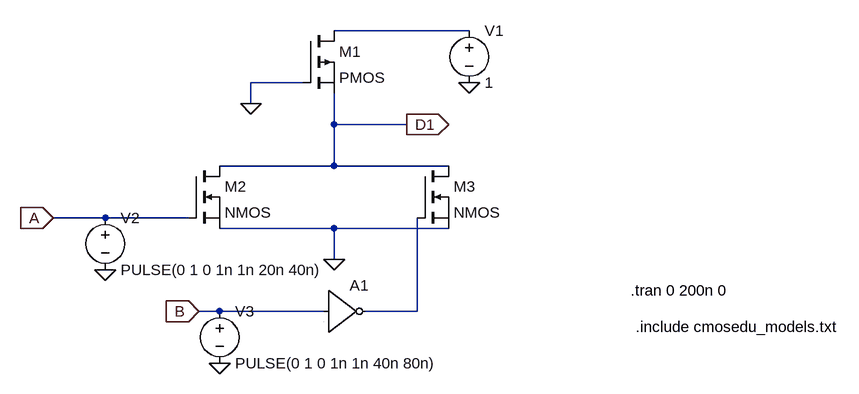
[diagram p0: schematic EXP 8 - D1.asc]
EXP 8 - D1.asc, the LTspice schematic file:
Version 4
SHEET 1 1156 680
WIRE 560 -64 352 -64
WIRE 304 16 224 16
WIRE 224 48 224 16
WIRE 352 80 352 32
WIRE 464 80 352 80
WIRE 352 144 352 80
WIRE 352 144 176 144
WIRE 528 144 352 144
WIRE 0 224 -80 224
WIRE 128 224 0 224
WIRE 352 240 176 240
WIRE 528 240 352 240
WIRE 352 288 352 240
WIRE 176 368 144 368
WIRE 336 368 176 368
WIRE 480 368 480 224
WIRE 480 368 400 368
FLAG 352 288 0
FLAG 0 304 0
FLAG 176 448 0
FLAG 560 16 0
FLAG -80 224 A
IOPIN -80 224 In
FLAG 144 368 B
IOPIN 144 368 In
FLAG 224 48 0
FLAG 464 80 D1
IOPIN 464 80 Out
SYMBOL pmos 304 -64 R0
SYMATTR InstName M1
SYMBOL nmos 128 144 R0
SYMATTR InstName M2
SYMBOL nmos 480 144 R0
SYMATTR InstName M3
SYMBOL voltage 560 -80 R0
WINDOW 123 0 0 Left 0
WINDOW 39 0 0 Left 0
SYMATTR InstName V1
SYMATTR Value 1
SYMBOL voltage 0 208 R0
WINDOW 123 0 0 Left 0
WINDOW 39 0 0 Left 0
SYMATTR InstName V2
SYMATTR Value PULSE(0 1 0 1n 1n 20n 40n)
SYMBOL voltage 176 352 R0
WINDOW 123 0 0 Left 0
WINDOW 39 0 0 Left 0
SYMATTR InstName V3
SYMATTR Value PULSE(0 1 0 1n 1n 40n 80n)
SYMBOL Digital\\inv 336 304 R0
SYMATTR InstName A1
TEXT 808 336 Left 2 !.tran 0 200n 0
TEXT 816 392 Left 2 !.include cmosedu_models.txt

The netlist it stands for:
* EXP 8 - D1.asc
M1 N001 0 D1 D1 PMOS
M2 D1 A 0 0 NMOS
M3 D1 N002 0 0 NMOS
V1 N001 0 1
V2 A 0 PULSE(0 1 0 1n 1n 20n 40n)
V3 B 0 PULSE(0 1 0 1n 1n 40n 80n)
A1 B 0 0 0 0 N002 0 0 BUF
.model NMOS NMOS
.model PMOS PMOS
.lib standard.mos
.tran 0 200n 0
.include cmosedu_models.txt
.backanno
.end